# EAGLE design gps_16_yobi (EAGLE 7.2.0)
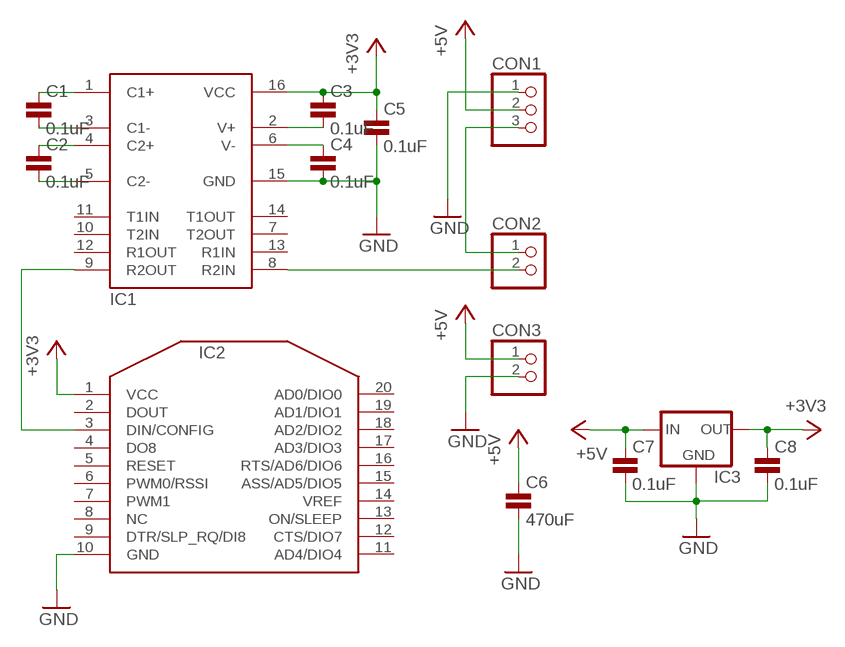
[diagram p0: schematic, sheet 1]

## Parts
C1  0.1uF  C0603  [0603]
C2  0.1uF  C0603  [0603]
C3  0.1uF  C0603  [0603]
C4  0.1uF  C0603  [0603]
C5  0.1uF  C0603  [0603]
C6  470uF  CC025-025X050  [C025-025X050]
C7  0.1uF  C0603  [0603]
C8  0.1uF  C0603  [0603]
CON1  PINHD-1X3  [1X03]
CON2  PINHD-1X2  [1X02]
CON3  PINHD-1X2  [1X02]
IC1  ADM3202ADM3202AN  [IC16PIN]
IC2  XBEE-PRO2MM  [XBEE-ZB]
IC3  78MXXS  [78MXXS]

## Nets
+3V3: C3.1 C5.1 C8.1 IC1.16(VCC) IC2.1(VCC) IC3.OUT
+5V: C6.1 C7.1 CON1.2 CON3.1 IC3.IN
GND: C4.2 C5.2 C6.2 C7.2 C8.2 CON1.1 CON3.2 IC1.15(GND) IC2.10(GND) IC3.GND
GPS_OUT: CON1.3 CON2.1
N$1: CON2.2 IC1.8(R2IN)
N$2: IC1.9(R2OUT) IC2.3(DIN/CONFIG)
N$3: C2.1 IC1.4(C2+)
N$4: C2.2 IC1.5(C2-)
N$5: C1.1 IC1.1(C1+)
N$6: C1.2 IC1.3(C1-)
N$7: C4.1 IC1.6(V-)
N$10: C3.2 IC1.2(V+)
Unconnected: IC1.7(T2OUT) IC1.10(T2IN) IC1.11(T1IN) IC1.12(R1OUT) IC1.13(R1IN) IC1.14(T1OUT) IC2.2(DOUT) IC2.4(DO8) IC2.5(RESET) IC2.6(PWM0/RSSI) IC2.7(PWM1) IC2.8(NC) IC2.9(DTR/SLP_RQ/DI8) IC2.11(AD4/DIO4) IC2.12(CTS/DIO7) IC2.13(ON/SLEEP) IC2.14(VREF) IC2.15(ASS/AD5/DIO5) IC2.16(RTS/AD6/DIO6) IC2.17(AD3/DIO3) IC2.18(AD2/DIO2) IC2.19(AD1/DIO1) IC2.20(AD0/DIO0)

## Library data of the parts
C1-C8 = untitled:C: CAPACITOR
CON1 = pinhead:PINHD-1X3: PIN HEADER
CON2 CON3 = pinhead:PINHD-1X2: PIN HEADER
IC1 = untitled:ADM3202
IC2 = untitled:XBEE-PRO: XBee
IC3 = v-reg:78MXXS: VOLTAGE REGULATOR

## Board
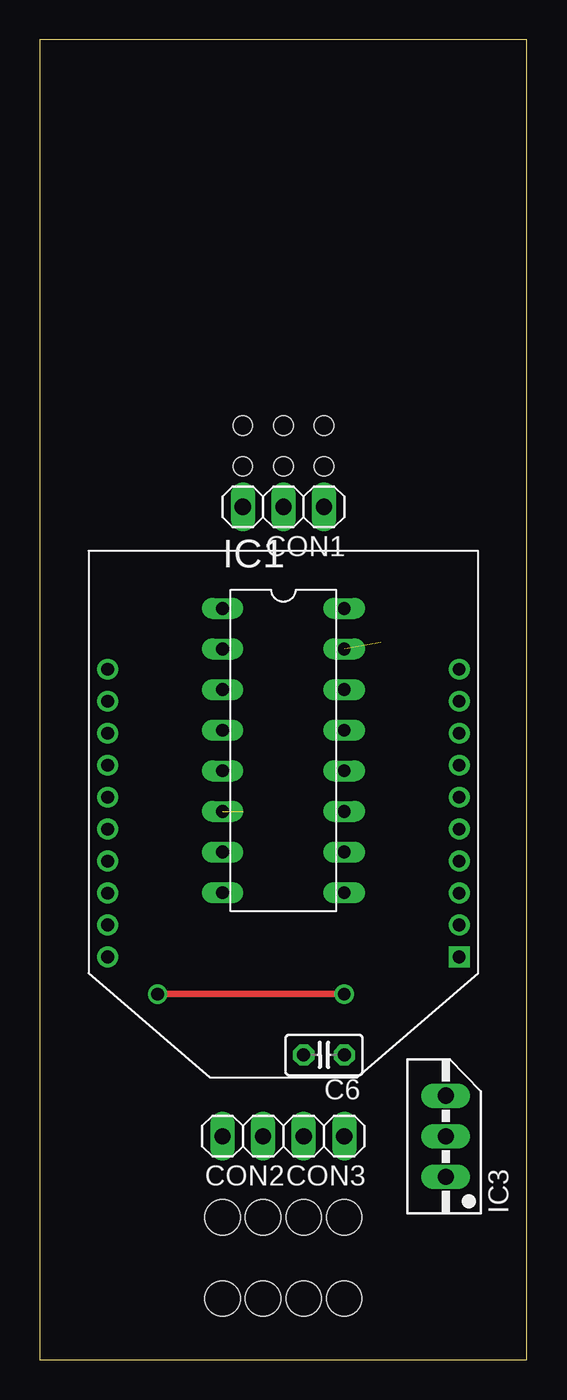
[diagram p1: board, top side]
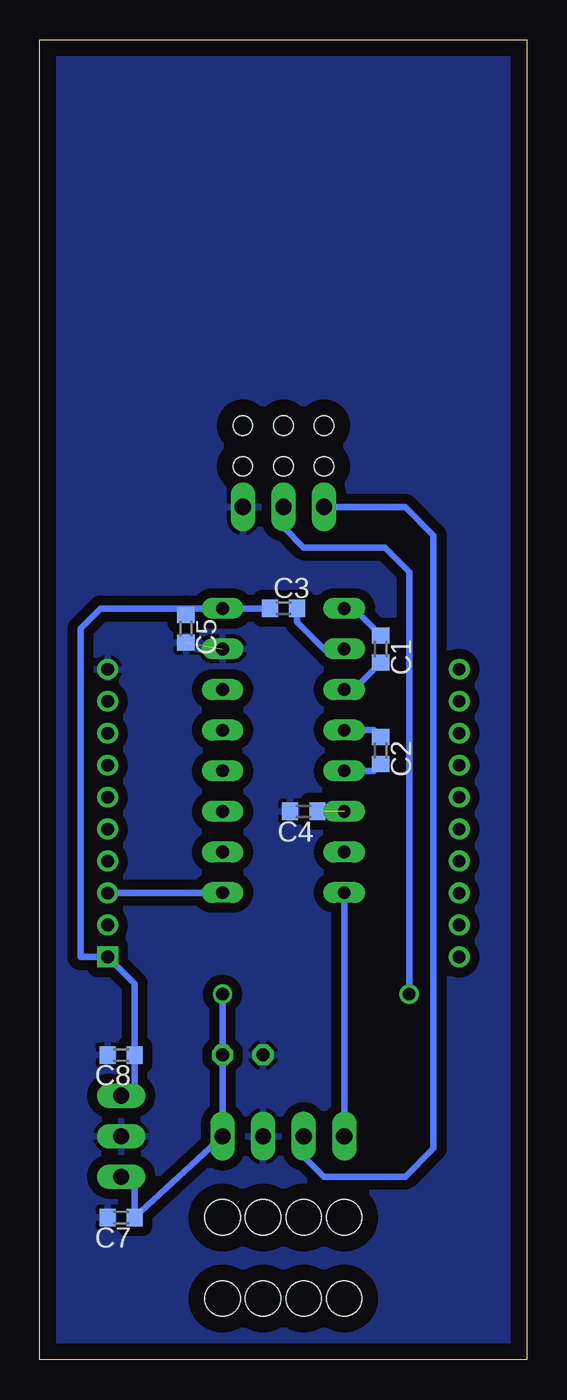
[diagram p2: board, bottom side, seen from below]

Size 30.48 x 82.55 mm. Coordinates in mm from the lower left corner, seen from the top.
Outline: 0,0 30.48,0 30.48,82.55 0,82.55 0,0
Copper layers (1*16): Top 0.035mm / dielectric 1.5mm / Bottom 0.035mm
Design rules "default": minimum track width 10mil, minimum drill 24mil, track to track 8mil, track to pad 8mil, pad to pad 8mil, via to via 8mil, smd to smd 8mil, copper to edge 40mil, drill to drill 8mil, minimum pad ring 10mil, minimum via ring 8mil, stop-mask expansion 4mil, vias tented up to drill 0mil, thermal gap 10mil
Holes 2.2 mm at 11.43,8.89 13.97,8.89 16.51,8.89 19.05,8.89 11.43,3.81 13.97,3.81 16.51,3.81 19.05,3.81
Holes 1.2 mm at 12.7,55.88 12.7,58.42 15.24,58.42 15.24,55.88 17.78,55.88 17.78,58.42

### Footprints (pad centres in the part's own frame; a part is rotated, then mirrored left to right if it is on the bottom)
0603 = smd 1 x 1.1: 1 -0.85,0; 2 0.85,0
C025-025X050 = drill 0.813 octagon: 1 -1.27,0; 2 1.27,0
1X03 = drill 1.016 long: 1 -2.54,0; 2 0,0; 3 2.54,0
1X02 = drill 1.016 long: 1 -1.27,0; 2 1.27,0
IC16PIN = drill 0.8 long: 1 -3.81,8.89; 2 -3.81,6.35; 3 -3.81,3.81; 4 -3.81,1.27; 5 -3.81,-1.27; 6 -3.81,-3.81; 7 -3.81,-6.35; 8 -3.81,-8.89; 9 3.81,-8.89; 10 3.81,-6.35; 11 3.81,-3.81; 12 3.81,-1.27; 13 3.81,1.27; 14 3.81,3.81; 15 3.81,6.35; 16 3.81,8.89
XBEE-ZB = drill 0.8 square: 1 -11,18 | drill 0.8: 2 -11,16; 3 -11,14; 4 -11,12; 5 -11,10; 6 -11,8; 7 -11,6; 8 -11,4; 9 -11,2; 10 -11,0; 11 11,0; 12 11,2; 13 11,4; 14 11,6; 15 11,8; 16 11,10; 17 11,12; 18 11,14; 19 11,16; 20 11,18
78MXXS = drill 1.016 long: GND 0,-2.54; IN -2.54,-2.54; OUT 2.54,-2.54

### Placement (x,y rotation side)
C1  9.14,44.45 270 bottom
C2  9.14,38.1 270 bottom
C3  15.24,46.99 0 bottom
C4  13.97,34.29 180 bottom
C5  21.34,45.72 270 bottom
C6  17.78,19.05 180 top
C7  25.4,8.89 180 bottom
C8  25.4,19.05 180 bottom
CON1  15.24,53.34 180 top
CON2  12.7,13.97 180 top
CON3  17.78,13.97 180 top
IC1  15.24,38.1 0 top
IC2  15.24,43.18 180 top
IC3  22.86,13.97 90 top

### Tracks (layer width: path | path; a pad name or v marks a point on that pad's centre or on a via)
+3V3
  Bottom 0.406: C5.1 21.34,46.99 IC1.16 | C3.1 IC1.16 | IC1.16 26.67,46.99 27.94,45.72 27.94,25.18 IC2.1 24.55,23.49 C8.1 24.55,16.51 IC3.OUT
+5V  (via drill 0.8)
  Top 0.406: v19.05,22.86 v7.37,22.86
  Bottom 0.406: v19.05,22.86 C6.1 CON3.1 C7.1 24.55,11.43 IC3.IN | CON1.2 15.24,52.07 13.97,50.8 8.89,50.8 7.37,49.28 v7.37,22.86
GND  (1 unrouted)
  pour Bottom (isolate 0.61): 0,82.55 30.48,82.55 30.48,0 0,0
GPS_OUT
  Bottom 0.406: CON1.3 7.62,53.34 5.84,51.56 5.84,13.21 7.62,11.43 12.7,11.43 13.97,12.7 CON2.1
N$1
  Bottom 0.406: CON2.2 IC1.8
N$2
  Bottom 0.406: IC1.9 19.08,29.18 IC2.3
N$3
  Bottom 0.406: C2.1 9.56,39.37 IC1.4
N$4
  Bottom 0.406: C2.2 9.56,36.83 IC1.5
N$5
  Bottom 0.406: C1.1 10.83,46.99 IC1.1
N$6
  Bottom 0.406: C1.2 10.83,41.91 IC1.3
N$7  (1 unrouted)
  Bottom 0.406: C4.1 12.7,34.29
N$10
  Bottom 0.406: C3.2 14.39,46.14 12.7,44.45 IC1.2